# Altium schematic sheet main-2.SchDoc
size A4
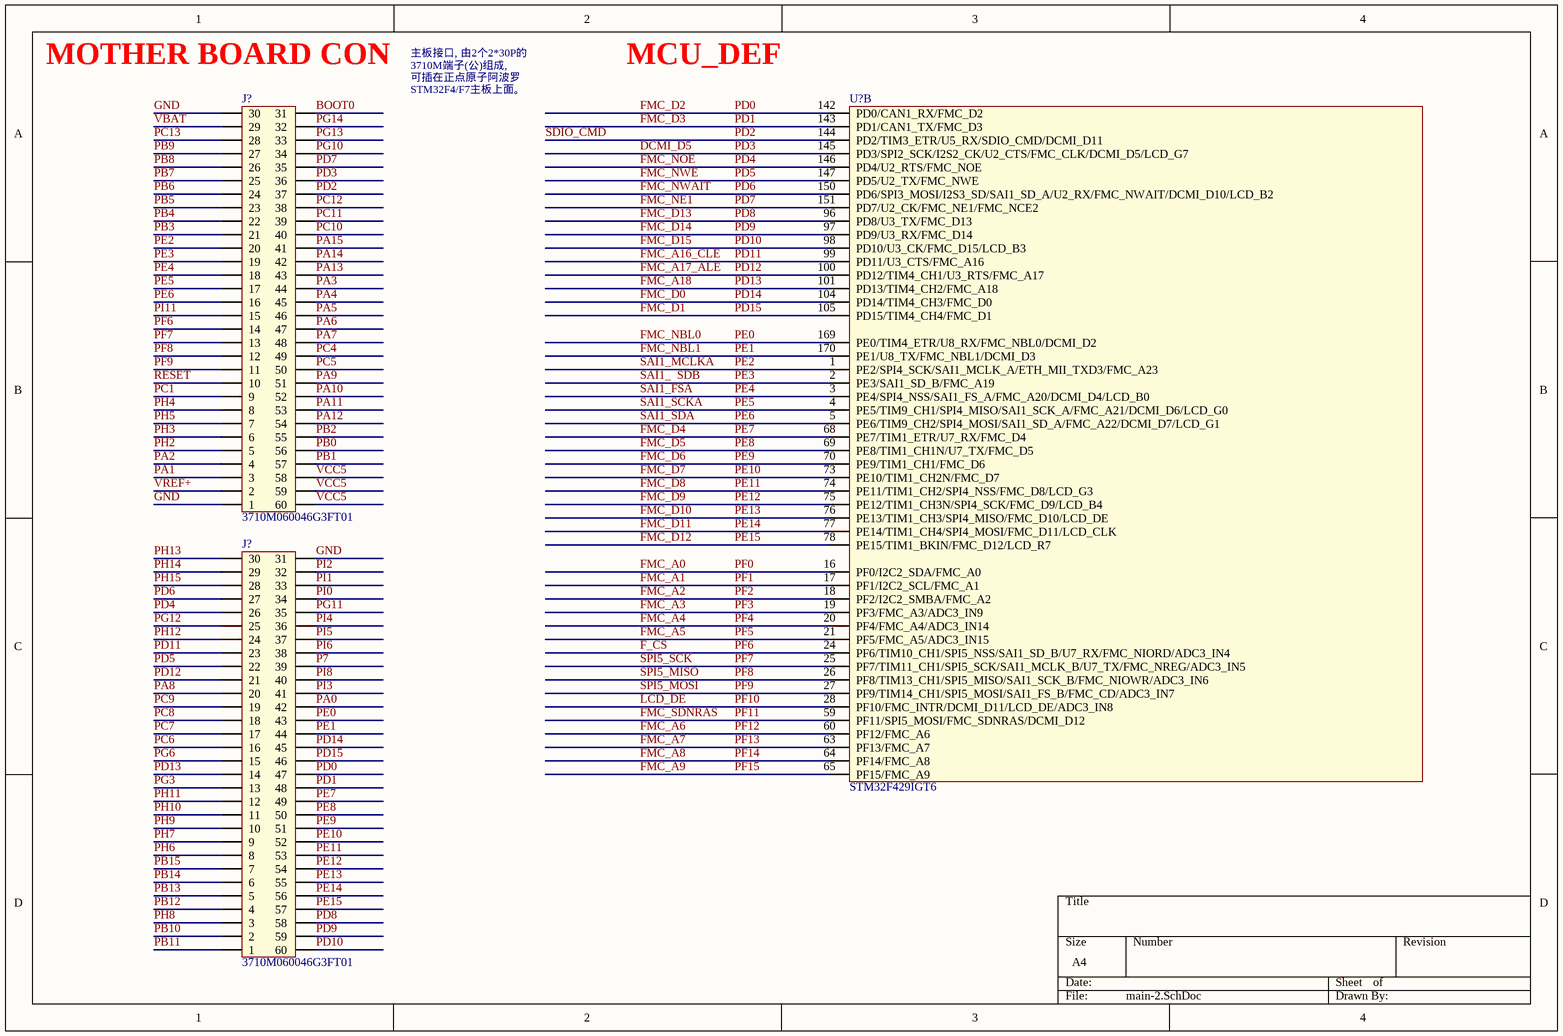
[diagram p0: main-2.SchDoc]

## Parts
(Parts that share a designator on the sheet are numbered #1, #2 ... from top to bottom, then left to right.)
J?#1  3710M060046G3FT01  [3710F060046G3FT01]
J?#2  3710M060046G3FT01  [3710F060046G3FT01]
U?  STM32F429IGT6  [LQFP176]  (part B of 3)

## Nets
BOOT0: J?#1.31
DCMI_D5: J?#1.36 U?.145(PD3/SPI2_SCK/I2S2_CK/U2_CTS/FMC_CLK/DCMI_D5/LCD_G7)  [also labelled PD3]
F_CS: J?#1.14 U?.24(PF6/TIM10_CH1/SPI5_NSS/SAI1_SD_B/U7_RX/FMC_NIORD/ADC3_IN4)  [also labelled PF6]
FMC_A0: U?.16(PF0/I2C2_SDA/FMC_A0)  [also labelled PF0]
FMC_A1: U?.17(PF1/I2C2_SCL/FMC_A1)  [also labelled PF1]
FMC_A2: U?.18(PF2/I2C2_SMBA/FMC_A2)  [also labelled PF2]
FMC_A3: U?.19(PF3/FMC_A3/ADC3_IN9)  [also labelled PF3]
FMC_A4: U?.20(PF4/FMC_A4/ADC3_IN14)  [also labelled PF4]
FMC_A5: U?.21(PF5/FMC_A5/ADC3_IN15)  [also labelled PF5]
FMC_A6: U?.60(PF12/FMC_A6)  [also labelled PF12]
FMC_A7: U?.63(PF13/FMC_A7)  [also labelled PF13]
FMC_A8: U?.64(PF14/FMC_A8)  [also labelled PF14]
FMC_A9: U?.65(PF15/FMC_A9)  [also labelled PF15]
FMC_A16_CLE: J?#2.23 U?.99(PD11/U3_CTS/FMC_A16)  [also labelled PD11]
FMC_A17_ALE: J?#2.21 U?.100(PD12/TIM4_CH1/U3_RTS/FMC_A17)  [also labelled PD12]
FMC_A18: J?#2.14 U?.101(PD13/TIM4_CH2/FMC_A18)  [also labelled PD13]
FMC_D0: J?#2.45 U?.104(PD14/TIM4_CH3/FMC_D0)  [also labelled PD14]
FMC_D1: J?#2.46 U?.105(PD15/TIM4_CH4/FMC_D1)  [also labelled PD15]
FMC_D2: J?#2.47 U?.142(PD0/CAN1_RX/FMC_D2)  [also labelled PD0]
FMC_D3: J?#2.48 U?.143(PD1/CAN1_TX/FMC_D3)  [also labelled PD1]
FMC_D4: J?#2.49 U?.68(PE7/TIM1_ETR/U7_RX/FMC_D4)  [also labelled PE7]
FMC_D5: J?#2.50 U?.69(PE8/TIM1_CH1N/U7_TX/FMC_D5)  [also labelled PE8]
FMC_D6: J?#2.51 U?.70(PE9/TIM1_CH1/FMC_D6)  [also labelled PE9]
FMC_D7: J?#2.52 U?.73(PE10/TIM1_CH2N/FMC_D7)  [also labelled PE10]
FMC_D8: J?#2.53 U?.74(PE11/TIM1_CH2/SPI4_NSS/FMC_D8/LCD_G3)  [also labelled PE11]
FMC_D9: J?#2.54 U?.75(PE12/TIM1_CH3N/SPI4_SCK/FMC_D9/LCD_B4)  [also labelled PE12]
FMC_D10: J?#2.55 U?.76(PE13/TIM1_CH3/SPI4_MISO/FMC_D10/LCD_DE)  [also labelled PE13]
FMC_D11: J?#2.56 U?.77(PE14/TIM1_CH4/SPI4_MOSI/FMC_D11/LCD_CLK)  [also labelled PE14]
FMC_D12: J?#2.57 U?.78(PE15/TIM1_BKIN/FMC_D12/LCD_R7)  [also labelled PE15]
FMC_D13: J?#2.58 U?.96(PD8/U3_TX/FMC_D13)  [also labelled PD8]
FMC_D14: J?#2.59 U?.97(PD9/U3_RX/FMC_D14)  [also labelled PD9]
FMC_D15: J?#2.60 U?.98(PD10/U3_CK/FMC_D15/LCD_B3)  [also labelled PD10]
FMC_NBL0: J?#2.43 U?.169(PE0/TIM4_ETR/U8_RX/FMC_NBL0/DCMI_D2)  [also labelled PE0]
FMC_NBL1: J?#2.44 U?.170(PE1/U8_TX/FMC_NBL1/DCMI_D3)  [also labelled PE1]
FMC_NE1: J?#1.35 U?.151(PD7/U2_CK/FMC_NE1/FMC_NCE2)  [also labelled PD7]
FMC_NOE: J?#2.26 U?.146(PD4/U2_RTS/FMC_NOE)  [also labelled PD4]
FMC_NWAIT: J?#2.27 U?.150(PD6/SPI3_MOSI/I2S3_SD/SAI1_SD_A/U2_RX/FMC_NWAIT/DCMI_D10/LCD_B2)  [also labelled PD6]
FMC_NWE: J?#2.22 U?.147(PD5/U2_TX/FMC_NWE)  [also labelled PD5]
FMC_SDNRAS: U?.59(PF11/SPI5_MOSI/FMC_SDNRAS/DCMI_D12)  [also labelled PF11]
GND: J?#1.1 J?#1.30 J?#2.31
LCD_DE: U?.28(PF10/FMC_INTR/DCMI_D11/LCD_DE/ADC3_IN8)  [also labelled PF10]
P7: J?#2.39
PA0: J?#2.42
PA1: J?#1.3
PA2: J?#1.4
PA3: J?#1.44
PA4: J?#1.45
PA5: J?#1.46
PA6: J?#1.47
PA7: J?#1.48
PA8: J?#2.20
PA9: J?#1.51
PA10: J?#1.52
PA11: J?#1.53
PA12: J?#1.54
PA13: J?#1.43
PA14: J?#1.42
PA15: J?#1.41
PB0: J?#1.56
PB1: J?#1.57
PB2: J?#1.55
PB3: J?#1.21
PB4: J?#1.22
PB5: J?#1.23
PB6: J?#1.24
PB7: J?#1.25
PB8: J?#1.26
PB9: J?#1.27
PB10: J?#2.2
PB11: J?#2.1
PB12: J?#2.4
PB13: J?#2.5
PB14: J?#2.6
PB15: J?#2.7
PC1: J?#1.9
PC4: J?#1.49
PC5: J?#1.50
PC6: J?#2.16
PC7: J?#2.17
PC8: J?#2.18
PC9: J?#2.19
PC10: J?#1.40
PC11: J?#1.39
PC12: J?#1.38
PC13: J?#1.28
PD2: J?#1.37 U?.144(PD2/TIM3_ETR/U5_RX/SDIO_CMD/DCMI_D11)  [also labelled SDIO_CMD]
PE2: J?#1.20 U?.1(PE2/SPI4_SCK/SAI1_MCLK_A/ETH_MII_TXD3/FMC_A23)  [also labelled SAI1_MCLKA]
PE3: J?#1.19 U?.2(PE3/SAI1_SD_B/FMC_A19)  [also labelled SAI1_  SDB]
PE4: J?#1.18 U?.3(PE4/SPI4_NSS/SAI1_FS_A/FMC_A20/DCMI_D4/LCD_B0)  [also labelled SAI1_FSA]
PE5: J?#1.17 U?.4(PE5/TIM9_CH1/SPI4_MISO/SAI1_SCK_A/FMC_A21/DCMI_D6/LCD_G0)  [also labelled SAI1_SCKA]
PE6: J?#1.16 U?.5(PE6/TIM9_CH2/SPI4_MOSI/SAI1_SD_A/FMC_A22/DCMI_D7/LCD_G1)  [also labelled SAI1_SDA]
PF7: J?#1.13 U?.25(PF7/TIM11_CH1/SPI5_SCK/SAI1_MCLK_B/U7_TX/FMC_NREG/ADC3_IN5)  [also labelled SPI5_SCK]
PF8: J?#1.12 U?.26(PF8/TIM13_CH1/SPI5_MISO/SAI1_SCK_B/FMC_NIOWR/ADC3_IN6)  [also labelled SPI5_MISO]
PF9: J?#1.11 U?.27(PF9/TIM14_CH1/SPI5_MOSI/SAI1_FS_B/FMC_CD/ADC3_IN7)  [also labelled SPI5_MOSI]
PG3: J?#2.13
PG6: J?#2.15
PG10: J?#1.34
PG11: J?#2.35
PG12: J?#2.25
PG13: J?#1.33
PG14: J?#1.32
PH2: J?#1.5
PH3: J?#1.6
PH4: J?#1.8
PH5: J?#1.7
PH6: J?#2.8
PH7: J?#2.9
PH8: J?#2.3
PH9: J?#2.10
PH10: J?#2.11
PH11: J?#2.12
PH12: J?#2.24
PH13: J?#2.30
PH14: J?#2.29
PH15: J?#2.28
PI0: J?#2.34
PI1: J?#2.33
PI2: J?#2.32
PI3: J?#2.41
PI4: J?#2.36
PI5: J?#2.37
PI6: J?#2.38
PI8: J?#2.40
PI11: J?#1.15
RESET: J?#1.10
VBAT: J?#1.29
VCC5: J?#1.58 J?#1.59 J?#1.60
VREF+: J?#1.2

## Notes on the sheet
- (near J?#1) MOTHER BOARD CON
- MCU_DEF
- 主板接口, 由2个2*30P的3710M端子(公)组成,
  可插在正点原子阿波罗STM32F4/F7主板上面。

## Library data of the parts
J?#1 J?#2 = 3710F: 3710F060046G3FT01
U? = STM32F429IGT6: 意法半导体MCU M4内核